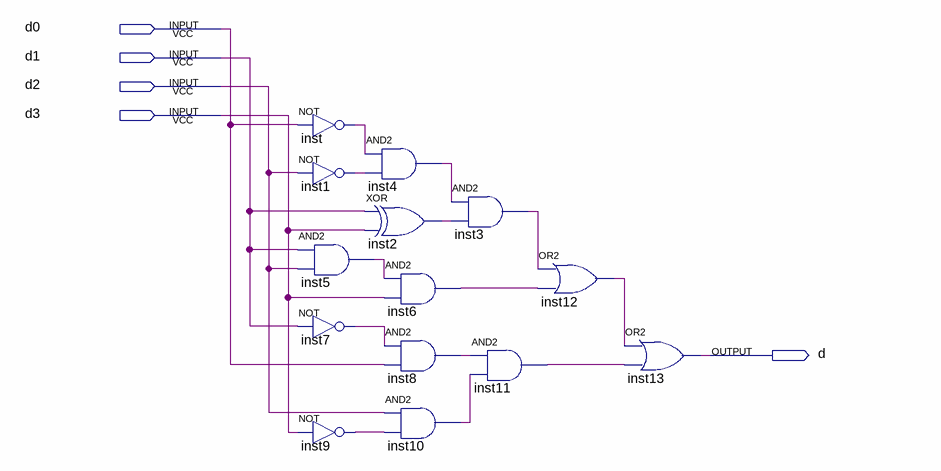
[diagram p0: schematic sheet]
// Quartus schematic d_segment.bdf as structural Verilog: 14 symbols, 5 pins
module d_segment (
  input  d0,
  input  d1,
  input  d2,
  input  d3,
  output d
);

  wire inst1_out, inst2_out, inst3_out, inst4_out, inst5_out, inst6_out, inst7_out, inst8_out, inst9_out,
       inst10_out, inst11_out, inst12_out, inst_out;

  not inst (inst_out, d0);
  not inst1 (inst1_out, d2);
  and inst5 (inst5_out, d1, d2);
  not inst7 (inst7_out, d1);
  not inst9 (inst9_out, d3);
  and inst4 (inst4_out, inst_out, inst1_out);
  xor inst2 (inst2_out, d1, d3);
  and inst6 (inst6_out, inst5_out, d3);
  and inst8 (inst8_out, inst7_out, d0);
  and inst10 (inst10_out, d2, inst9_out);
  and inst3 (inst3_out, inst4_out, inst2_out);
  and inst11 (inst11_out, inst8_out, inst10_out);
  or inst12 (inst12_out, inst3_out, inst6_out);
  or inst13 (d, inst12_out, inst11_out);
endmodule
